# Altium project ArduinoUnoSheild.PrjPcb
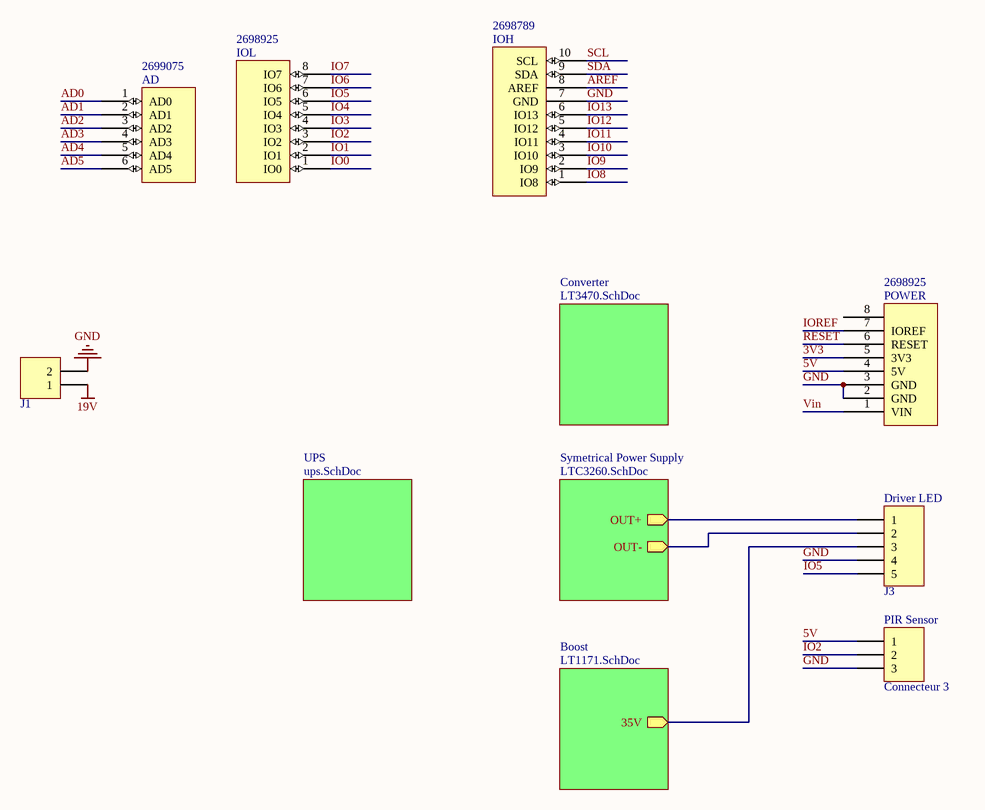
[diagram p0: ArduinoUnoShield.SchDoc]
5 sheets, 62 parts. Net scope: hierarchical (ports join the sheet entries above them; power ports are global).
Board file: ArduinoUnoShield.PcbDoc
Sheets:
  ArduinoUnoShield.SchDoc
    UPS = ups.SchDoc
    Converter = LT3470.SchDoc
    Symetrical Power Supply = LTC3260.SchDoc
    Boost = LT1171.SchDoc

## Sheet ArduinoUnoShield.SchDoc
size A4

### Parts
(Parts that share a designator on the sheet are numbered #1, #2 ... from top to bottom, then left to right.)
AD  Supplier Part Number 4: 2699075  [Header 6x1 8.5mm]  (hidden comment: AD)
IOH  Supplier Part Number 3: 2698789  [Header 10x1 8.5mm]  (hidden comment: IOH)
IOL  Supplier Part Number 4: 2698925  [Header 8x1 8.5mm]  (hidden comment: IOL)
J1#1  Connecteur 2  [Jack_connector]  (value not drawn)
J3  Driver LED  [Connector 5]
PIR_Sensor  Connecteur 3  [Connector 3]
POWER  Supplier Part Number 4: 2698925  [Header 8x1 8.5mm]  (hidden comment: POWER_UNO)

### Sub-sheets
Boost = LT1171.SchDoc: 35V (out)
Converter = LT3470.SchDoc: no entries
Symetrical Power Supply = LTC3260.SchDoc: OUT+ (out), OUT- (out)
UPS = ups.SchDoc: no entries

### Nets
19V: J1#1.1
GND: IOH.7(GND) J1#1.2 J3.4 PIR_Sensor.3 POWER.2(GND) POWER.3(GND)
3V3: POWER.5(3V3)
5V: PIR_Sensor.1 POWER.4(5V)
AD0: AD.1(AD0)
AD1: AD.2(AD1)
AD2: AD.3(AD2)
AD3: AD.4(AD3)
AD4: AD.5(AD4)
AD5: AD.6(AD5)
AREF: IOH.8(AREF)
IO0: IOL.1(IO0)
IO1: IOL.2(IO1)
IO2: IOL.3(IO2) PIR_Sensor.2
IO3: IOL.4(IO3)
IO4: IOL.5(IO4)
IO5: IOL.6(IO5) J3.5
IO6: IOL.7(IO6)
IO7: IOL.8(IO7)
IO8: IOH.1(IO8)
IO9: IOH.2(IO9)
IO10: IOH.3(IO10)
IO11: IOH.4(IO11)
IO12: IOH.5(IO12)
IO13: IOH.6(IO13)
IOREF: POWER.7(IOREF)
RESET: POWER.6(RESET)
SCL: IOH.10(SCL)
SDA: IOH.9(SDA)
Vin: POWER.1(VIN)
NetC15_1: J3.1 ; sheet Symetrical Power Supply/OUT+
NetC16_1: J3.2 ; sheet Symetrical Power Supply/OUT-
NetC18_1: J3.3 ; sheet Boost/35V

Not connected (* = marked no-connect by the designer): POWER 8

### Library data of the parts
J1#1 = Connecteur 2: Connecteur; Designer: ECAM 2005; Type: Connecteur à vis
J3 = Connecteur 5: Connecteur; Designer: ECAM 2004
AD = AD: Supplier 1: Arrow; Supplier Part Number 1: 2699089; Supplier 2: Digi-Key; Supplier Part Number 2: SAM1198-06-ND; Supplier 3: Arrow; Supplier Part Number 3: 2699088; Supplier 4: Arrow
IOH = IOH: Supplier 1: Arrow; Supplier Part Number 1: 2698803S4475693N1004; Supplier 2: Digi-Key; Supplier Part Number 2: SAM1198-10-ND; Supplier 3: Arrow
IOL = IOL: Supplier 1: Digi-Key; Supplier Part Number 1: SAM1198-08-ND; Supplier 2: Arrow; Supplier Part Number 2: 2698939; Supplier 3: Arrow; Supplier Part Number 3: 2698940; Supplier 4: Arrow
POWER = POWER_UNO: Supplier 1: Digi-Key; Supplier Part Number 1: SAM1198-08-ND; Supplier 2: Arrow; Supplier Part Number 2: 2698939; Supplier 3: Arrow; Supplier Part Number 3: 2698940; Supplier 4: Arrow

## Sheet ups.SchDoc
size A4
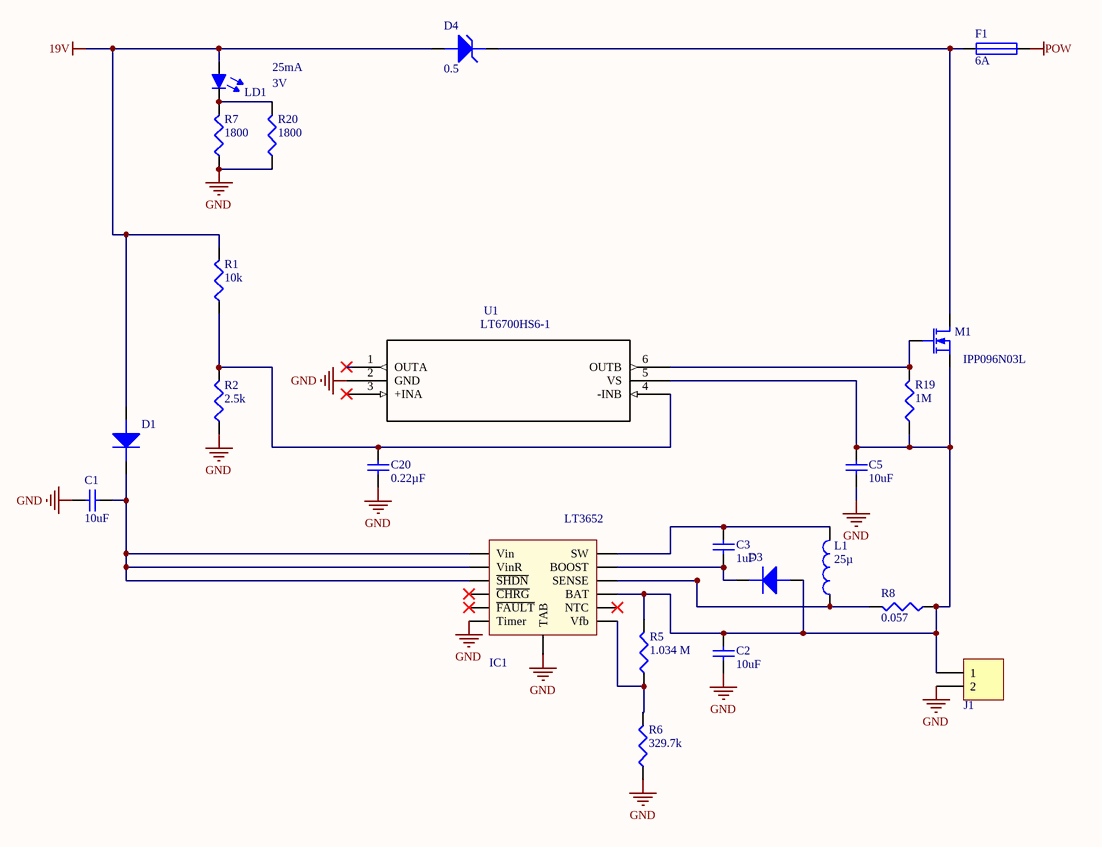
[diagram p1: ups.SchDoc]

### Parts
(Parts that share a designator on the sheet are numbered #1, #2 ... from top to bottom, then left to right.)
C1  10uF  [0805 CAP]
C2  10uF  [0805 CAP]
C3  1uF  [0805 CAP]
C5  10uF  [0805 CAP]
C20  0.22µF  [0805 CAP]
D1  Diode  [SMB]  (value not drawn)
D3  Diode  [SMB]  (value not drawn)
D4  Voltage: 0.5  [DIODE-0.4]  (hidden comment: Diode Zener)
F1  value 6A  [Fuse_holder]  (hidden comment: Fusible)
IC1  LT3652  [MSOP12 - EP]
J1#2  Connecteur 2  [Terminal block - 2 ways]  (value not drawn)
L1  value 25µ  [INDPM7070X580N]  (hidden comment: Inductance)
LD1  Forward Current If: 25mA  Forward Voltage: 3V  [LED_0603]  (hidden comment: LED diode)
M1  IPP096N03L  [TO-220 V]
R1  value 10k  [0603 RES]  (hidden comment: Résistance)
R2  value 2.5k  [0603 RES]  (hidden comment: Résistance)
R5  value 1.034 M  [0603 RES]  (hidden comment: Résistance)
R6  value 329.7k  [0603 RES]  (hidden comment: Résistance)
R7  value 1800  [1206 RES]  (hidden comment: Résistance)
R8  value 0.057  [1812 RES]  (hidden comment: Résistance)
R19  value 1M  [0603 RES]  (hidden comment: Résistance)
R20  value 1800  [1206 RES]  (hidden comment: Résistance)
U1  LT6700HS6-1  [*TSOT-23_S6]

### Nets
19V: D1.1(A) D4.1(A) LD1.1(A1) R1.2
GND: C1.2 C2.2 C5.1 C20.2 IC1.6(Timer) IC1.13(TAB) J1#2.2 R2.1 R6.1 R7.1 R20.1 U1.2(GND)
POW: F1.2(F2)
NetC1_1: C1.1 D1.2(K) IC1.1(Vin) IC1.2(VinR) IC1.3(~{SHDN})
NetC2_1: C2.1 C5.2 D3.1(A) IC1.9(BAT) J1#2.1 M1.3(S) R5.2 R8.1 R19.1 U1.5(VS)
NetC3_1: C3.1 D3.2(K) IC1.11(BOOST)
NetC3_2: C3.2 IC1.12(SW) L1.2
NetC20_1: C20.1 R1.1 R2.2 U1.4(-INB)
NetD4_2: D4.2(K) F1.1(F1) M1.2(D)
NetIC1_7: IC1.7(Vfb) R5.1 R6.2
NetIC1_10: IC1.10(SENSE) L1.1 R8.2
NetLD1_2: LD1.2(K) R7.2 R20.2
NetM1_1: M1.1(G) R19.2 U1.6(OUTB)

Not connected (* = marked no-connect by the designer): IC1 4(~{CHRG})* 5(~{FAULT})* 8(NTC)*; U1 1(OUTA)* 3(+INA)*

### Library data of the parts
C1 C2 = 1uF/0805: Manufacturer: Murata; Manufacturer Part Number: GCM21BR7YA105KA55L; Capacitance: 10 µF; Dielectric: X7R; Tolerance (%): ±10 %; Rated Voltage: 35 V; Supplier 1: Farnell; Stock 1: 3630; Pricing 1: 5=0.391, 50=0.21, 250=0.162, 500=0.111 (EUR); Case Size/Dimension: 0805; ComponentLink1URL: https://datasheet.ciiva.com/11616/product-11616620.pdf; ComponentLink1Description: https://datasheet.ciiva.com/11616/product-11616620.pdf; ComponentLink2URL: https://datasheet.ciiva.com/138/s0717e-138752.pdf; ComponentLink2Description: https://datasheet.ciiva.com/138/s0717e-138752.pdf; ComponentLink3URL: https://datasheet.ciiva.com/138/s0717e-138753.pdf; ComponentLink3Description: https://datasheet.ciiva.com/138/s0717e-138753.pdf; ComponentLink4URL: https://datasheet.ciiva.com/18183/getdatasheetpartid-251151-18183719.pdf; ComponentLink4Description: https://datasheet.ciiva.com/18183/getdatasheetpartid-251151-18183719.pdf; ComponentLink5URL: https://datasheet.ciiva.com/138/s0717e-138751.pdf; ComponentLink5Description: https://datasheet.ciiva.com/138/s0717e-138751.pdf; Supplier Part Number 1: 2494199
C3 C5 = 1uF/0805: Manufacturer: Murata; Manufacturer Part Number: GCM21BR7YA105KA55L; Capacitance: 1 µF; Dielectric: X7R; Tolerance (%): ±10 %; Rated Voltage: 35 V; Supplier 1: Farnell; Stock 1: 3630; Pricing 1: 5=0.391, 50=0.21, 250=0.162, 500=0.111 (EUR); Case Size/Dimension: 0805; ComponentLink1URL: https://datasheet.ciiva.com/11616/product-11616620.pdf; ComponentLink1Description: https://datasheet.ciiva.com/11616/product-11616620.pdf; ComponentLink2URL: https://datasheet.ciiva.com/138/s0717e-138752.pdf; ComponentLink2Description: https://datasheet.ciiva.com/138/s0717e-138752.pdf; ComponentLink3URL: https://datasheet.ciiva.com/138/s0717e-138753.pdf; ComponentLink3Description: https://datasheet.ciiva.com/138/s0717e-138753.pdf; ComponentLink4URL: https://datasheet.ciiva.com/18183/getdatasheetpartid-251151-18183719.pdf; ComponentLink4Description: https://datasheet.ciiva.com/18183/getdatasheetpartid-251151-18183719.pdf; ComponentLink5URL: https://datasheet.ciiva.com/138/s0717e-138751.pdf; ComponentLink5Description: https://datasheet.ciiva.com/138/s0717e-138751.pdf; Supplier Part Number 1: 2494199
C20 = 1uF/0805: Manufacturer: Murata; Manufacturer Part Number: GCM21BR7YA105KA55L; Capacitance: 220 nF; Dielectric: X7R; Tolerance (%): ±10 %; Rated Voltage: 35 V; Supplier 1: Farnell; Stock 1: 3630; Pricing 1: 5=0.391, 50=0.21, 250=0.162, 500=0.111 (EUR); Case Size/Dimension: 0805; ComponentLink1URL: https://datasheet.ciiva.com/11616/product-11616620.pdf; ComponentLink1Description: https://datasheet.ciiva.com/11616/product-11616620.pdf; ComponentLink2URL: https://datasheet.ciiva.com/138/s0717e-138752.pdf; ComponentLink2Description: https://datasheet.ciiva.com/138/s0717e-138752.pdf; ComponentLink3URL: https://datasheet.ciiva.com/138/s0717e-138753.pdf; ComponentLink3Description: https://datasheet.ciiva.com/138/s0717e-138753.pdf; ComponentLink4URL: https://datasheet.ciiva.com/18183/getdatasheetpartid-251151-18183719.pdf; ComponentLink4Description: https://datasheet.ciiva.com/18183/getdatasheetpartid-251151-18183719.pdf; ComponentLink5URL: https://datasheet.ciiva.com/138/s0717e-138751.pdf; ComponentLink5Description: https://datasheet.ciiva.com/138/s0717e-138751.pdf; Supplier Part Number 1: 2494199
D1 D3 = Diode: Type: Diode standard; Designer: ECAM 2003
D4 = Diode Zener: Diode Zéner; Type: Diode Zéner 10 V; Designer: ECAM 2005
IC1 = LTC3652: Manufacturer: Analog Devices / Linear Technology; Manufacturer Part Number: LT3652EMSE#PBF; Dynamic Catalog: Charge Management, Specialized; Other Related Documents: Power-Tracking Batt-Charger Article / Designing a Solar Cell Battery Charger; Product Training Modules: LT3652 Multi-Chemistry Battery Charger for Solar Power; Featured Product: Energy Harvesting Power Products; Reference Design Library: DC1568A(#1):  2 Cell, 8.2V, 2A Max, Solar / DC1568A(#2):  2 Cell, 8.2V, 2A Max, Solar; Function: Charge Management, Solar; Battery Chemistry: Lead Acid, LiFePO4, Li-Ion, Li-Pol, NiCd, NiMH; Voltage - Supply: 4.95 V ~ 32 V; For Use With: DC1568A-ND / - BOARD BATTERY CHARGER SOLAR PWR / DC1688A-ND / - EVAL BOARD BATT CHARGER LT3652; Other Names: LT3652EMSEPBF; Value: LTC3652; Supplier 1: Farnell; Stock 1: 0; Standard Package: 37; Category: Integrated Circuits (ICs); Family: PMIC - Battery Management; Series: -; Packaging: Tube; Operating Temperature: -40°C ~ 125°C; Mounting Type: Surface Mount; Package / Case: 12-TSSOP (0.118", 3.00mm Width) Exposed Pad; Supplier Device Package: 12-MSOP-EP; Online Catalog: Charge Management, Specialized; ComponentLink1URL: https://datasheet.ciiva.com/15114/getdatasheetpartid-367678-15114671.pdf; ComponentLink1Description: https://datasheet.ciiva.com/15114/getdatasheetpartid-367678-15114671.pdf; ComponentLink2URL: https://datasheet.ciiva.com/1932/28522-1932092.pdf; ComponentLink2Description: https://datasheet.ciiva.com/1932/28522-1932092.pdf; ComponentLink3URL: https://datasheet.ciiva.com/1139/1692510-1139705.pdf; ComponentLink3Description: https://datasheet.ciiva.com/1139/1692510-1139705.pdf; Supplier Part Number 1: 1839126
J1#2 = Connecteur 2: Connecteur; Designer: ECAM 2005; Type: Connecteur à vis
LD1 = LED diode: LED; Manufacturer: Multicomp; Manufacturer Part Number: 703-0112; LED Colour: Red; LED Mounting: SMD; Wavelength Typ: 643nm; Luminous Intensity: 15mcd; Viewing Angle: 140°; Lens Shape: Rectangular; Supplier 1: Farnell; Stock 1: 627; Pricing 1: 5=0.163, 25=0.139, 100=0.108, 250=0.0887, 500=0.0813, 1000=0.075 (EUR); Bulb Size: -; Packaging: Each; Product Range: -; Automotive Qualification Standard: -; ComponentLink1URL: https://datasheet.ciiva.com/1244/1758066-1244070.pdf; ComponentLink1Description: https://datasheet.ciiva.com/1244/1758066-1244070.pdf; ComponentLink2URL: https://datasheet.ciiva.com/23621/1626779-23621468.pdf; ComponentLink2Description: https://datasheet.ciiva.com/23621/1626779-23621468.pdf; Supplier Part Number 1: 2112124
M1 = NMOS-IPP096: MOSFET; Value: NMOS; Designer: ECAM 2002; Type: Mosfet canal N
R1 R2 R5-R8 R19 R20 = Résistance: Résistance standard; Designer: ECAM 2005; Type: Résistance standard
U1 = LT6700HS6-1: Analog Comparators LT6700 - Micropower, Low Voltage, Dual Comparator with 400mV Reference; MF: Linear Technology; MP: LT6700HS6-1; Package: None; Price: None; Availability: Unavailable; SnapEDA_Link: https://www.snapeda.com/parts/LT6700HS6-1/Analog%20Devices/view-part/?ref=snap; Value: *
F1 = Fusible: Designer: ECAM 2004; Type: Fusible
L1 = Inductance: Designer: ECAM 2003

## Sheet LT3470.SchDoc
size A4
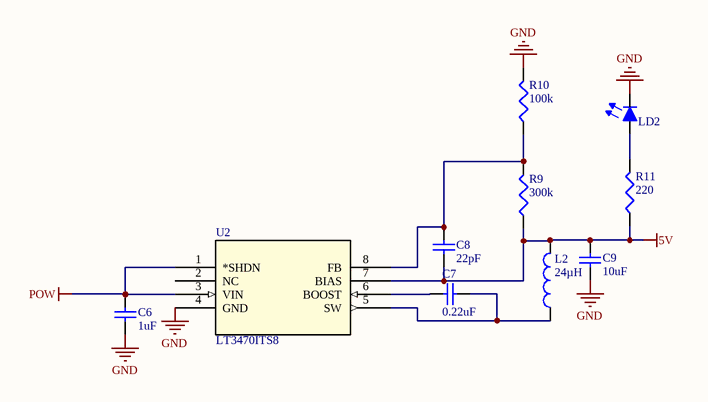
[diagram p2: LT3470.SchDoc]

### Parts
C6  1uF  [0805 CAP]
C7  0.22uF  [0805 CAP]
C8  22pF  [0805 CAP]
C9  10uF  [0805 CAP]
L2  value 24µH  [INDPM7070X580N]  (hidden comment: Inductance)
LD2  green  [LED_0603]  (value not drawn)
R9  value 300k  [0603 RES]  (hidden comment: Résistance)
R10  value 100k  [0603 RES]  (hidden comment: Résistance)
R11  value 220  [0603 RES]  (hidden comment: Résistance)
U2  LT3470ITS8  [TSOT-23_TS8]

### Nets
5V: C8.1 C9.1 L2.2 R9.1 R11.1 U2.7(BIAS)
GND: C6.1 C9.2 LD2.2(K) R10.2 U2.4(GND)
POW: C6.2 U2.1(*SHDN) U2.3(VIN)
NetC7_1: C7.1 U2.6(BOOST)
NetC7_2: C7.2 L2.1 U2.5(SW)
NetC8_2: C8.2 R9.2 R10.1 U2.8(FB)
NetLD2_1: LD2.1(A1) R11.2

Not connected (* = marked no-connect by the designer): U2 2(NC)

### Library data of the parts
C6 = 1uF/0805: as C3 on sheet ups; Supplier 1: Farnell; Stock 1: 3630; Pricing 1: 5=0.391, 50=0.21, 250=0.162, 500=0.111 (EUR); Case Size/Dimension: 0805; ComponentLink1URL: https://datasheet.ciiva.com/11616/product-11616620.pdf; ComponentLink1Description: https://datasheet.ciiva.com/11616/product-11616620.pdf; ComponentLink2URL: https://datasheet.ciiva.com/138/s0717e-138752.pdf; ComponentLink2Description: https://datasheet.ciiva.com/138/s0717e-138752.pdf; ComponentLink3URL: https://datasheet.ciiva.com/138/s0717e-138753.pdf; ComponentLink3Description: https://datasheet.ciiva.com/138/s0717e-138753.pdf; ComponentLink4URL: https://datasheet.ciiva.com/18183/getdatasheetpartid-251151-18183719.pdf; ComponentLink4Description: https://datasheet.ciiva.com/18183/getdatasheetpartid-251151-18183719.pdf; ComponentLink5URL: https://datasheet.ciiva.com/138/s0717e-138751.pdf; ComponentLink5Description: https://datasheet.ciiva.com/138/s0717e-138751.pdf; Supplier Part Number 1: 2494199
C7 = 1uF/0805: Manufacturer: Murata; Manufacturer Part Number: GCM21BR7YA105KA55L; Capacitance: 0.22 µF; Dielectric: X7R; Tolerance (%): ±10 %; Rated Voltage: 35 V; Supplier 1: Farnell; Stock 1: 3630; Pricing 1: 5=0.391, 50=0.21, 250=0.162, 500=0.111 (EUR); Case Size/Dimension: 0805; ComponentLink1URL: https://datasheet.ciiva.com/11616/product-11616620.pdf; ComponentLink1Description: https://datasheet.ciiva.com/11616/product-11616620.pdf; ComponentLink2URL: https://datasheet.ciiva.com/138/s0717e-138752.pdf; ComponentLink2Description: https://datasheet.ciiva.com/138/s0717e-138752.pdf; ComponentLink3URL: https://datasheet.ciiva.com/138/s0717e-138753.pdf; ComponentLink3Description: https://datasheet.ciiva.com/138/s0717e-138753.pdf; ComponentLink4URL: https://datasheet.ciiva.com/18183/getdatasheetpartid-251151-18183719.pdf; ComponentLink4Description: https://datasheet.ciiva.com/18183/getdatasheetpartid-251151-18183719.pdf; ComponentLink5URL: https://datasheet.ciiva.com/138/s0717e-138751.pdf; ComponentLink5Description: https://datasheet.ciiva.com/138/s0717e-138751.pdf; Supplier Part Number 1: 2494199
C8 = 1uF/0805: Manufacturer: Murata; Manufacturer Part Number: GCM21BR7YA105KA55L; Dielectric: X7R; Tolerance (%): ±10 %; Rated Voltage: 35 V; Supplier 1: Farnell; Stock 1: 3630; Pricing 1: 5=0.391, 50=0.21, 250=0.162, 500=0.111 (EUR); Capacitance: 22 pF; Case Size/Dimension: 0805; ComponentLink1URL: https://datasheet.ciiva.com/11616/product-11616620.pdf; ComponentLink1Description: https://datasheet.ciiva.com/11616/product-11616620.pdf; ComponentLink2URL: https://datasheet.ciiva.com/138/s0717e-138752.pdf; ComponentLink2Description: https://datasheet.ciiva.com/138/s0717e-138752.pdf; ComponentLink3URL: https://datasheet.ciiva.com/138/s0717e-138753.pdf; ComponentLink3Description: https://datasheet.ciiva.com/138/s0717e-138753.pdf; ComponentLink4URL: https://datasheet.ciiva.com/18183/getdatasheetpartid-251151-18183719.pdf; ComponentLink4Description: https://datasheet.ciiva.com/18183/getdatasheetpartid-251151-18183719.pdf; ComponentLink5URL: https://datasheet.ciiva.com/138/s0717e-138751.pdf; ComponentLink5Description: https://datasheet.ciiva.com/138/s0717e-138751.pdf; Supplier Part Number 1: 2494199
C9 = 1uF/0805: as C1 on sheet ups; Supplier 1: Farnell; Stock 1: 3630; Pricing 1: 5=0.391, 50=0.21, 250=0.162, 500=0.111 (EUR); Case Size/Dimension: 0805; ComponentLink1URL: https://datasheet.ciiva.com/11616/product-11616620.pdf; ComponentLink1Description: https://datasheet.ciiva.com/11616/product-11616620.pdf; ComponentLink2URL: https://datasheet.ciiva.com/138/s0717e-138752.pdf; ComponentLink2Description: https://datasheet.ciiva.com/138/s0717e-138752.pdf; ComponentLink3URL: https://datasheet.ciiva.com/138/s0717e-138753.pdf; ComponentLink3Description: https://datasheet.ciiva.com/138/s0717e-138753.pdf; ComponentLink4URL: https://datasheet.ciiva.com/18183/getdatasheetpartid-251151-18183719.pdf; ComponentLink4Description: https://datasheet.ciiva.com/18183/getdatasheetpartid-251151-18183719.pdf; ComponentLink5URL: https://datasheet.ciiva.com/138/s0717e-138751.pdf; ComponentLink5Description: https://datasheet.ciiva.com/138/s0717e-138751.pdf; Supplier Part Number 1: 2494199
LD2 = LED diode: LED green; Manufacturer: Multicomp; Manufacturer Part Number: 703-0112; LED Colour: Red; LED Mounting: SMD; Forward Current If: 20mA; Forward Voltage: 1.8V; Wavelength Typ: 643nm; Luminous Intensity: 15mcd; Viewing Angle: 140°; Lens Shape: Rectangular; Supplier 1: Farnell; Stock 1: 627; Pricing 1: 5=0.163, 25=0.139, 100=0.108, 250=0.0887, 500=0.0813, 1000=0.075 (EUR); Bulb Size: -; Packaging: Each; Product Range: -; Automotive Qualification Standard: -; ComponentLink1URL: https://datasheet.ciiva.com/1244/1758066-1244070.pdf; ComponentLink1Description: https://datasheet.ciiva.com/1244/1758066-1244070.pdf; ComponentLink2URL: https://datasheet.ciiva.com/23621/1626779-23621468.pdf; ComponentLink2Description: https://datasheet.ciiva.com/23621/1626779-23621468.pdf; Supplier Part Number 1: 2112124
R9-R11 = Résistance: Résistance standard; Designer: ECAM 2005; Type: Résistance standard
U2 = LT3470ITS8: No Description Available; Vendor: Linear Technology; Manufacturer_Part_Number: LT3470ITS8; Copyright: Copyright (C) 2018 Accelerated Designs. All rights reserved; RefDes: RefDes; Type: DEV; Value: Value
L2 = Inductance: Designer: ECAM 2003

## Sheet LTC3260.SchDoc
size A4
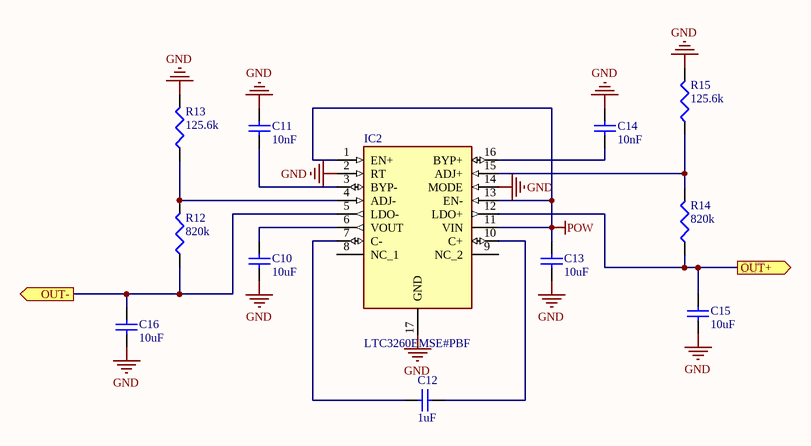
[diagram p3: LTC3260.SchDoc]

### Parts
C10  10uF  [0805 CAP]
C11  10nF  [0603 RES]
C12  1uF  [0805 CAP]
C13  10uF  [0805 CAP]
C14  10nF  [0603 RES]
C15  10uF  [0805 CAP]
C16  10uF  [0805 CAP]
IC2  LTC3260EMSE#PBF  [SOP50P490X110-17N]
R12  value 820k  [0603 RES]  (hidden comment: Résistance)
R13  value 125.6k  [0603 RES]  (hidden comment: Résistance)
R14  value 820k  [0603 RES]  (hidden comment: Résistance)
R15  value 125.6k  [0603 RES]  (hidden comment: Résistance)

### Ports
OUT+ (out), OUT- (out)

### Nets
GND: C10.2 C11.1 C13.1 C14.2 C15.2 C16.2 IC2.2(RT) IC2.14(MODE) IC2.17(GND) R13.2 R15.2
POW: C13.2 IC2.1(EN+) IC2.11(VIN) IC2.13(EN-)
NetC10_1: C10.1 IC2.6(VOUT)
NetC11_2: C11.2 IC2.3(BYP-)
NetC12_1: C12.1 IC2.7(C-)
NetC12_2: C12.2 IC2.10(C+)
NetC14_1: C14.1 IC2.16(BYP+)
NetC15_1: C15.1 IC2.12(LDO+) R14.1 ; port OUT+
NetC16_1: C16.1 IC2.5(LDO-) R12.1 ; port OUT-
NetIC2_4: IC2.4(ADJ-) R12.2 R13.1
NetIC2_15: IC2.15(ADJ+) R14.2 R15.1

Not connected (* = marked no-connect by the designer): IC2 8(NC_1) 9(NC_2)

### Library data of the parts
C10 C13 C15 C16 = 1uF/0805: as C1 on sheet ups; Supplier 1: Farnell; Stock 1: 3630; Pricing 1: 5=0.391, 50=0.21, 250=0.162, 500=0.111 (EUR); Case Size/Dimension: 0805; ComponentLink1URL: https://datasheet.ciiva.com/11616/product-11616620.pdf; ComponentLink1Description: https://datasheet.ciiva.com/11616/product-11616620.pdf; ComponentLink2URL: https://datasheet.ciiva.com/138/s0717e-138752.pdf; ComponentLink2Description: https://datasheet.ciiva.com/138/s0717e-138752.pdf; ComponentLink3URL: https://datasheet.ciiva.com/138/s0717e-138753.pdf; ComponentLink3Description: https://datasheet.ciiva.com/138/s0717e-138753.pdf; ComponentLink4URL: https://datasheet.ciiva.com/18183/getdatasheetpartid-251151-18183719.pdf; ComponentLink4Description: https://datasheet.ciiva.com/18183/getdatasheetpartid-251151-18183719.pdf; ComponentLink5URL: https://datasheet.ciiva.com/138/s0717e-138751.pdf; ComponentLink5Description: https://datasheet.ciiva.com/138/s0717e-138751.pdf; Supplier Part Number 1: 2494199
C11 C14 = 1uF/0805: as C8 on sheet LT3470; Supplier 1: Farnell; Stock 1: 3630; Pricing 1: 5=0.391, 50=0.21, 250=0.162, 500=0.111 (EUR); Capacitance: 10 nF; Case Size/Dimension: 0805; ComponentLink1URL: https://datasheet.ciiva.com/11616/product-11616620.pdf; ComponentLink1Description: https://datasheet.ciiva.com/11616/product-11616620.pdf; ComponentLink2URL: https://datasheet.ciiva.com/138/s0717e-138752.pdf; ComponentLink2Description: https://datasheet.ciiva.com/138/s0717e-138752.pdf; ComponentLink3URL: https://datasheet.ciiva.com/138/s0717e-138753.pdf; ComponentLink3Description: https://datasheet.ciiva.com/138/s0717e-138753.pdf; ComponentLink4URL: https://datasheet.ciiva.com/18183/getdatasheetpartid-251151-18183719.pdf; ComponentLink4Description: https://datasheet.ciiva.com/18183/getdatasheetpartid-251151-18183719.pdf; ComponentLink5URL: https://datasheet.ciiva.com/138/s0717e-138751.pdf; ComponentLink5Description: https://datasheet.ciiva.com/138/s0717e-138751.pdf; Supplier Part Number 1: 2494199
C12 = 1uF/0805: as C3 on sheet ups; Supplier 1: Farnell; Stock 1: 3630; Pricing 1: 5=0.391, 50=0.21, 250=0.162, 500=0.111 (EUR); Case Size/Dimension: 0805; ComponentLink1URL: https://datasheet.ciiva.com/11616/product-11616620.pdf; ComponentLink1Description: https://datasheet.ciiva.com/11616/product-11616620.pdf; ComponentLink2URL: https://datasheet.ciiva.com/138/s0717e-138752.pdf; ComponentLink2Description: https://datasheet.ciiva.com/138/s0717e-138752.pdf; ComponentLink3URL: https://datasheet.ciiva.com/138/s0717e-138753.pdf; ComponentLink3Description: https://datasheet.ciiva.com/138/s0717e-138753.pdf; ComponentLink4URL: https://datasheet.ciiva.com/18183/getdatasheetpartid-251151-18183719.pdf; ComponentLink4Description: https://datasheet.ciiva.com/18183/getdatasheetpartid-251151-18183719.pdf; ComponentLink5URL: https://datasheet.ciiva.com/138/s0717e-138751.pdf; ComponentLink5Description: https://datasheet.ciiva.com/138/s0717e-138751.pdf; Supplier Part Number 1: 2494199
IC2 = LTC3260EMSE#PBF: Integrated Circuit; Manufacturer_Name: Linear Technology; Datasheet Link: http://cds.linear.com/docs/en/datasheet/3260fa.pdf; Height: 1.1mm; Manufacturer_Part_Number: LTC3260EMSE#PBF; Mouser Part Number: 584-LTC3260EMSE#PBF; Mouser Price/Stock: https://www.mouser.com/Search/Refine.aspx?Keyword=584-LTC3260EMSE%23PBF; RS Part Number: 8516768P; RS Price/Stock: http://uk.rs-online.com/web/p/products/8516768P
R12-R15 = Résistance: Résistance standard; Designer: ECAM 2005; Type: Résistance standard

## Sheet LT1171.SchDoc
size A4
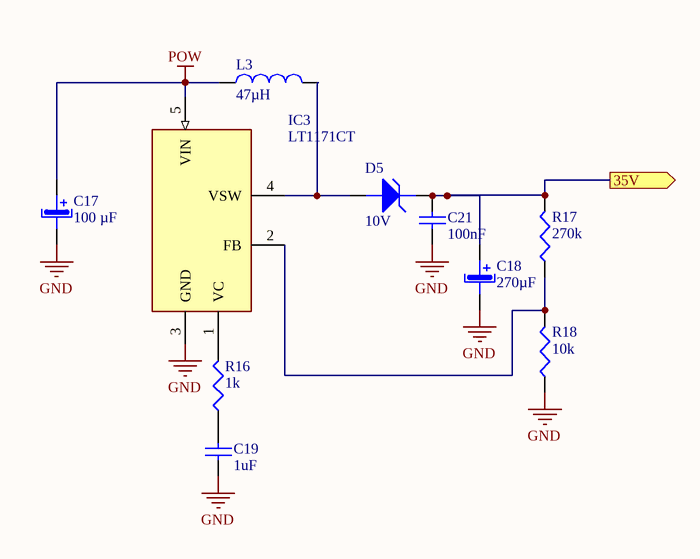
[diagram p4: LT1171.SchDoc]

### Parts
C17  value 100 µF  [CAPP-6x3]  (hidden comment: Cond pol radial)
C18  value 270µF  [CAPPR2-5x10]  (hidden comment: Cond pol radial)
C19  1uF  [0805 CAP]
C21  100nF  [0805 CAP]
D5  Voltage: 10V  [DIODE-0.4]  (hidden comment: Diode Zener)
IC3  LT1171CT  [TO170P457X1022X2306-5P]
L3  value 47µH  [Self100uH]  (hidden comment: Inductance)
R16  value 1k  [0603 RES]  (hidden comment: Résistance)
R17  value 270k  [0603 RES]  (hidden comment: Résistance)
R18  value 10k  [0603 RES]  (hidden comment: Résistance)

### Ports
35V (out)

### Nets
GND: C17.2(-) C18.2(-) C19.1 C21.1 IC3.3(GND) R18.1
POW: C17.1(+) IC3.5(VIN) L3.1
NetC18_1: C18.1(+) C21.2 D5.2(K) R17.2 ; port 35V
NetC19_2: C19.2 R16.1
NetD5_1: D5.1(A) IC3.4(VSW) L3.2
NetIC3_1: IC3.1(VC) R16.2
NetIC3_2: IC3.2(FB) R17.1 R18.2

### Library data of the parts
C17 C18 = Cond pol radial: Condensateur polatisé; Type: Condensateur polarisé debout; Designer: ECAM 2004
C19 = 1uF/0805: as C3 on sheet ups; Supplier 1: Farnell; Stock 1: 3630; Pricing 1: 5=0.391, 50=0.21, 250=0.162, 500=0.111 (EUR); Case Size/Dimension: 0805; ComponentLink1URL: https://datasheet.ciiva.com/11616/product-11616620.pdf; ComponentLink1Description: https://datasheet.ciiva.com/11616/product-11616620.pdf; ComponentLink2URL: https://datasheet.ciiva.com/138/s0717e-138752.pdf; ComponentLink2Description: https://datasheet.ciiva.com/138/s0717e-138752.pdf; ComponentLink3URL: https://datasheet.ciiva.com/138/s0717e-138753.pdf; ComponentLink3Description: https://datasheet.ciiva.com/138/s0717e-138753.pdf; ComponentLink4URL: https://datasheet.ciiva.com/18183/getdatasheetpartid-251151-18183719.pdf; ComponentLink4Description: https://datasheet.ciiva.com/18183/getdatasheetpartid-251151-18183719.pdf; ComponentLink5URL: https://datasheet.ciiva.com/138/s0717e-138751.pdf; ComponentLink5Description: https://datasheet.ciiva.com/138/s0717e-138751.pdf; Supplier Part Number 1: 2494199
C21 = 1uF/0805: as C8 on sheet LT3470; Supplier 1: Farnell; Stock 1: 3630; Pricing 1: 5=0.391, 50=0.21, 250=0.162, 500=0.111 (EUR); Capacitance: 100 nF; Case Size/Dimension: 0805; ComponentLink1URL: https://datasheet.ciiva.com/11616/product-11616620.pdf; ComponentLink1Description: https://datasheet.ciiva.com/11616/product-11616620.pdf; ComponentLink2URL: https://datasheet.ciiva.com/138/s0717e-138752.pdf; ComponentLink2Description: https://datasheet.ciiva.com/138/s0717e-138752.pdf; ComponentLink3URL: https://datasheet.ciiva.com/138/s0717e-138753.pdf; ComponentLink3Description: https://datasheet.ciiva.com/138/s0717e-138753.pdf; ComponentLink4URL: https://datasheet.ciiva.com/18183/getdatasheetpartid-251151-18183719.pdf; ComponentLink4Description: https://datasheet.ciiva.com/18183/getdatasheetpartid-251151-18183719.pdf; ComponentLink5URL: https://datasheet.ciiva.com/138/s0717e-138751.pdf; ComponentLink5Description: https://datasheet.ciiva.com/138/s0717e-138751.pdf; Supplier Part Number 1: 2494199
D5 = Diode Zener: Diode Zéner; Type: Diode Zéner 10 V; Designer: ECAM 2005
IC3 = LT1171CT#PBF: Integrated Circuit; Manufacturer_Name: Linear Technology; Datasheet Link: http://docs-emea.rs-online.com/webdocs/13ec/0900766b813ec9fd.pdf; Height: 4.572mm; Manufacturer_Part_Number: LT1171CT#PBF; Mouser Part Number: 584-LT1171CT#PBF; Mouser Price/Stock: https://www.mouser.com/Search/Refine.aspx?Keyword=584-LT1171CT%23PBF; RS Part Number: 5455001; RS Price/Stock: https://uk.rs-online.com/web/p/products/5455001
R16-R18 = Résistance: Résistance standard; Designer: ECAM 2005; Type: Résistance standard
L3 = Inductance: Designer: ECAM 2003

## Nets that join several sheets
19V: ArduinoUnoShield (J1#1.1), ups (D1.1 D4.1 LD1.1 R1.2)
GND: ArduinoUnoShield (6 pins), ups (12 pins), LT3470 (5 pins), LTC3260 (11 pins), LT1171 (6 pins)
POW: ups (F1.2), LT3470 (C6.2 U2.1 U2.3), LTC3260 (C13.2 IC2.1 IC2.11 IC2.13), LT1171 (C17.1 IC3.5 L3.1)
NetC15_1: ArduinoUnoShield (J3.1), LTC3260 (C15.1 IC2.12 R14.1)
NetC16_1: ArduinoUnoShield (J3.2), LTC3260 (C16.1 IC2.5 R12.1)
NetC18_1: ArduinoUnoShield (J3.3), LT1171 (C18.1 C21.2 D5.2 R17.2)